# EAGLE design metaPixel-Controller (EAGLE 8.3.1)

## Sheet 1 of 2: CPU
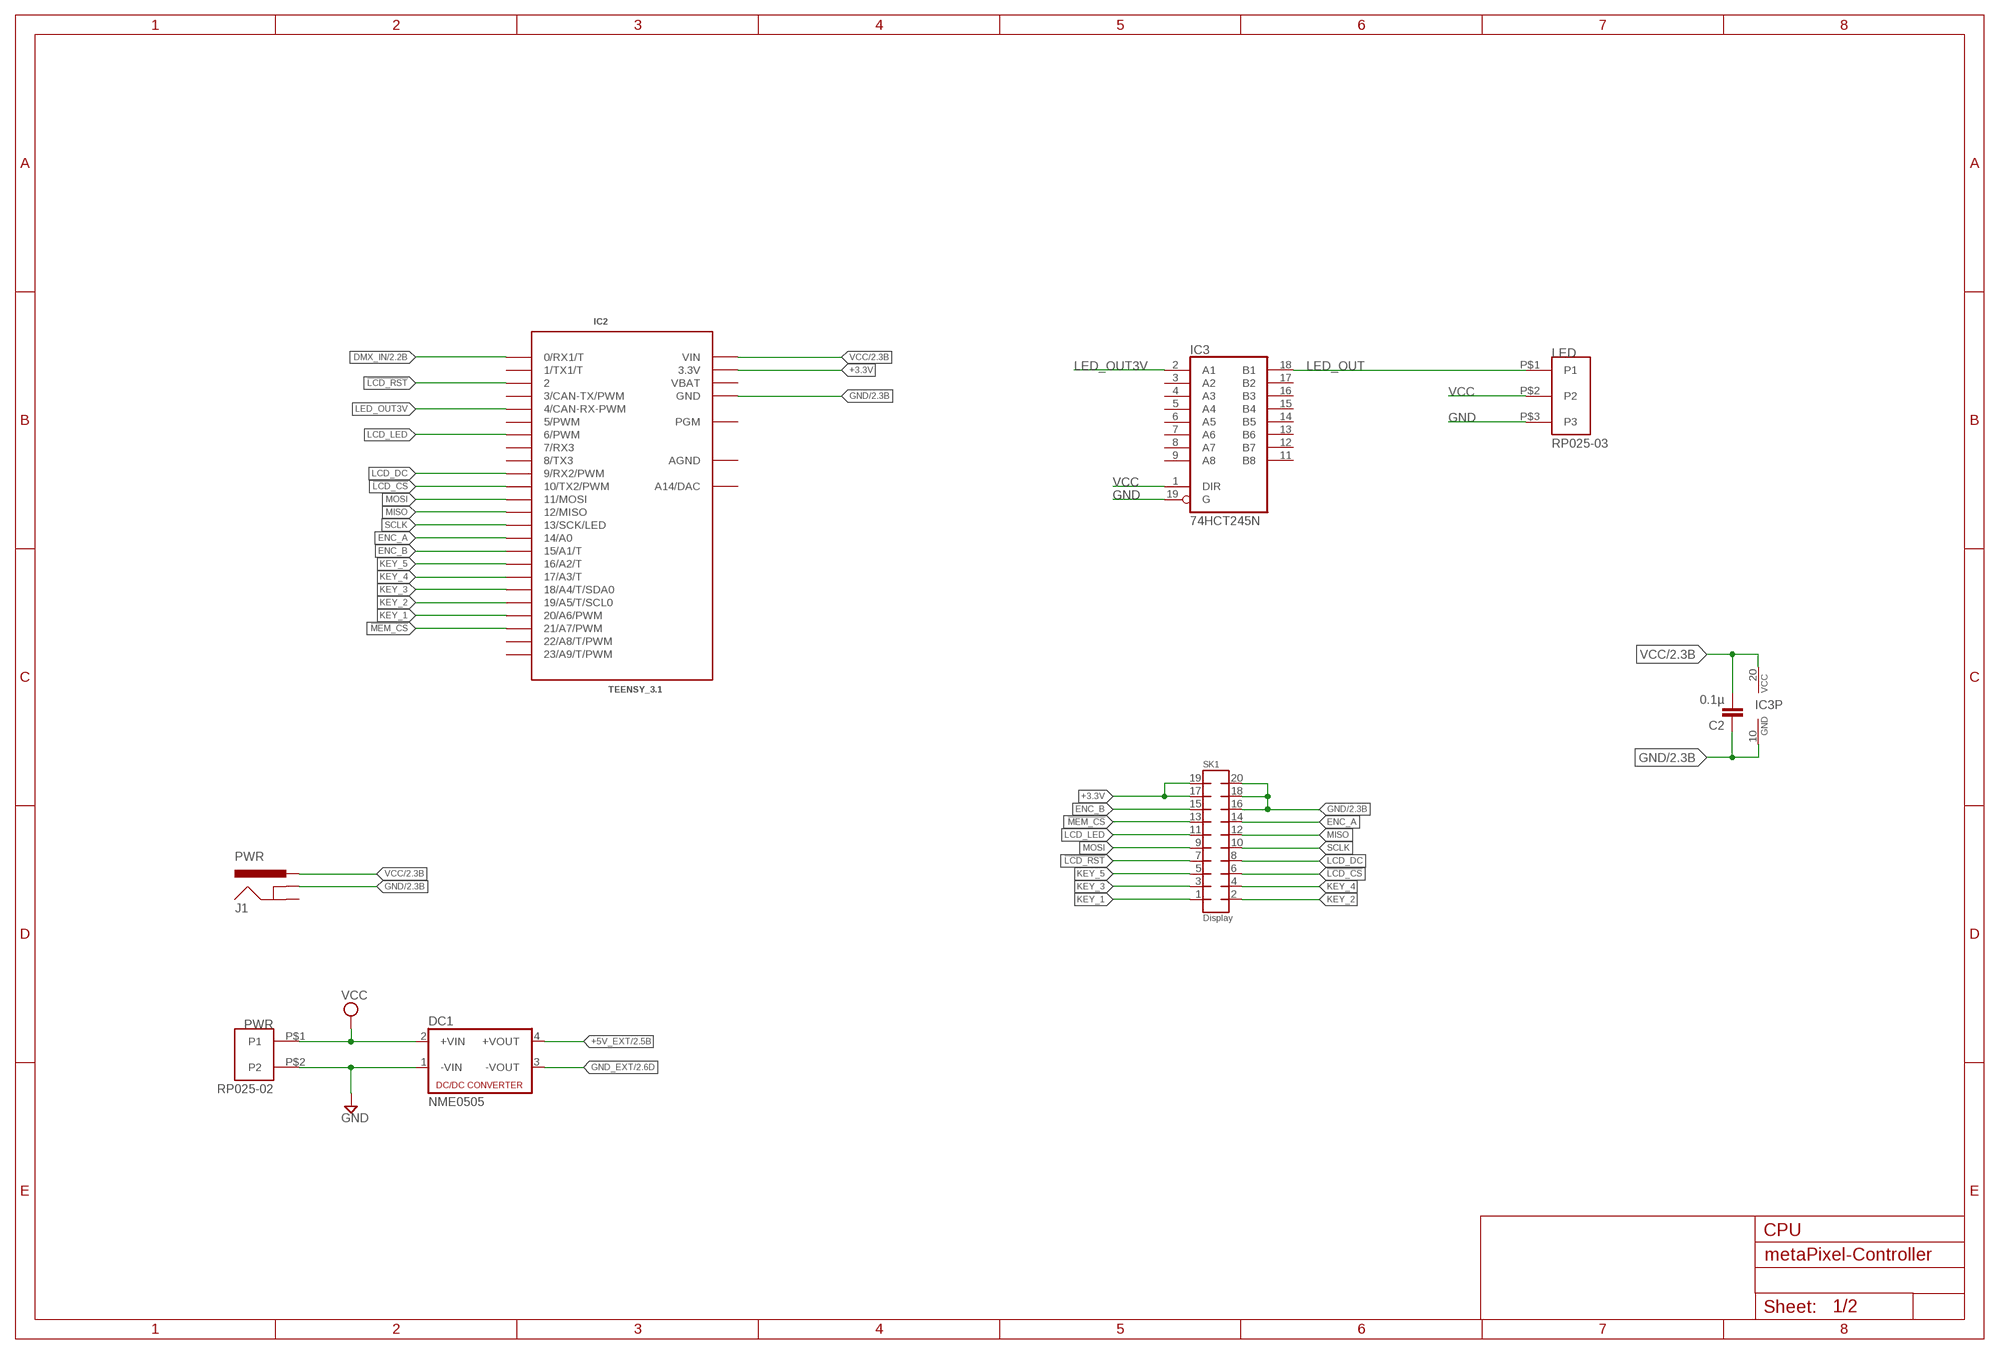
[diagram p0: schematic, sheet 1]

### Parts
C2  0.1µ  C-EU025-030X050  [C025-030X050]
DC1  NME0505  NME  [NME]
IC2  TEENSY_3.1  TEENSY_3.1_OUTER_ROW  [TEENSY3-OUTER_ROW]
IC3  74HCT245N  [DIL20]
J1  PWR  POWER_JACKSLT  [POWER_JACK_SLOT]
LED  RP025-03  [RP025-03]
PWR  RP025-02  [RP025-02]
SK1  Display  MMATCH-20-PTH  [AMP-215079-20]

### Nets
!LCD_CS: IC2.10(10/TX2/PWM) SK1.6
!LCD_RST: IC2.2 SK1.7
!MEM_CS: IC2.21/A7(21/A7/PWM) SK1.13
+3.3V [SUPPLY]: IC2.3.3V IC2.3.3V1(3.3V) SK1.17 SK1.19
+5V_EXT [SUPPLY]: DC1.4(+VOUT) ; also sheet 2
DMX_IN [SUPPLY]: IC2.0(0/RX1/T) ; also sheet 2
ENC_A: IC2.14/A0 SK1.14
ENC_B: IC2.15/A1(15/A1/T) SK1.15
GND [SUPPLY]: C2.1 DC1.1(-VIN) IC2.GND IC2.GND1(GND) IC3.10(GND) IC3.19(G) J1.GND@1(GNDBREAK) LED.P$3(P3) PWR.P$2(P2) SK1.16 SK1.18 SK1.20 ; also sheet 2
GND_EXT [SUPPLY]: DC1.3(-VOUT) ; also sheet 2
KEY_1: IC2.20/A6(20/A6/PWM) SK1.1
KEY_2: IC2.19/A5(19/A5/T/SCL0) SK1.2
KEY_3: IC2.18/A4(18/A4/T/SDA0) SK1.3
KEY_4: IC2.17/A3(17/A3/T) SK1.4
KEY_5: IC2.16/A2(16/A2/T) SK1.5
LCD_DC: IC2.9(9/RX2/PWM) SK1.8
LCD_LED: IC2.6(6/PWM) SK1.11
LED_OUT [SUPPLY]: IC3.18(B1) LED.P$1(P1)
LED_OUT3V: IC2.4(4/CAN-RX-PWM) IC3.2(A1)
MISO: IC2.12(12/MISO) SK1.12
MOSI: IC2.11(11/MOSI) SK1.9
SCLK: IC2.13(13/SCK/LED) SK1.10
VCC [SUPPLY]: C2.2 DC1.2(+VIN) IC2.VIN IC3.1(DIR) IC3.20(VCC) J1.PWR LED.P$2(P2) PWR.P$1(P1) ; also sheet 2
Unconnected: IC2.1(1/TX1/T) IC2.3(3/CAN-TX/PWM) IC2.5(5/PWM) IC2.7(7/RX3) IC2.8(8/TX3) IC2.22/A8(22/A8/T/PWM) IC2.23/A9(23/A9/T/PWM) IC2.PGM IC2.RESET/DAC(A14/DAC) IC3.3(A2) IC3.4(A3) IC3.5(A4) IC3.6(A5) IC3.7(A6) IC3.8(A7) IC3.9(A8) IC3.11(B8) IC3.12(B7) IC3.13(B6) IC3.14(B5) IC3.15(B4) IC3.16(B3) IC3.17(B2) J1.GND@2(GND)

### Notes on the sheet
- CPU

## Sheet 2 of 2
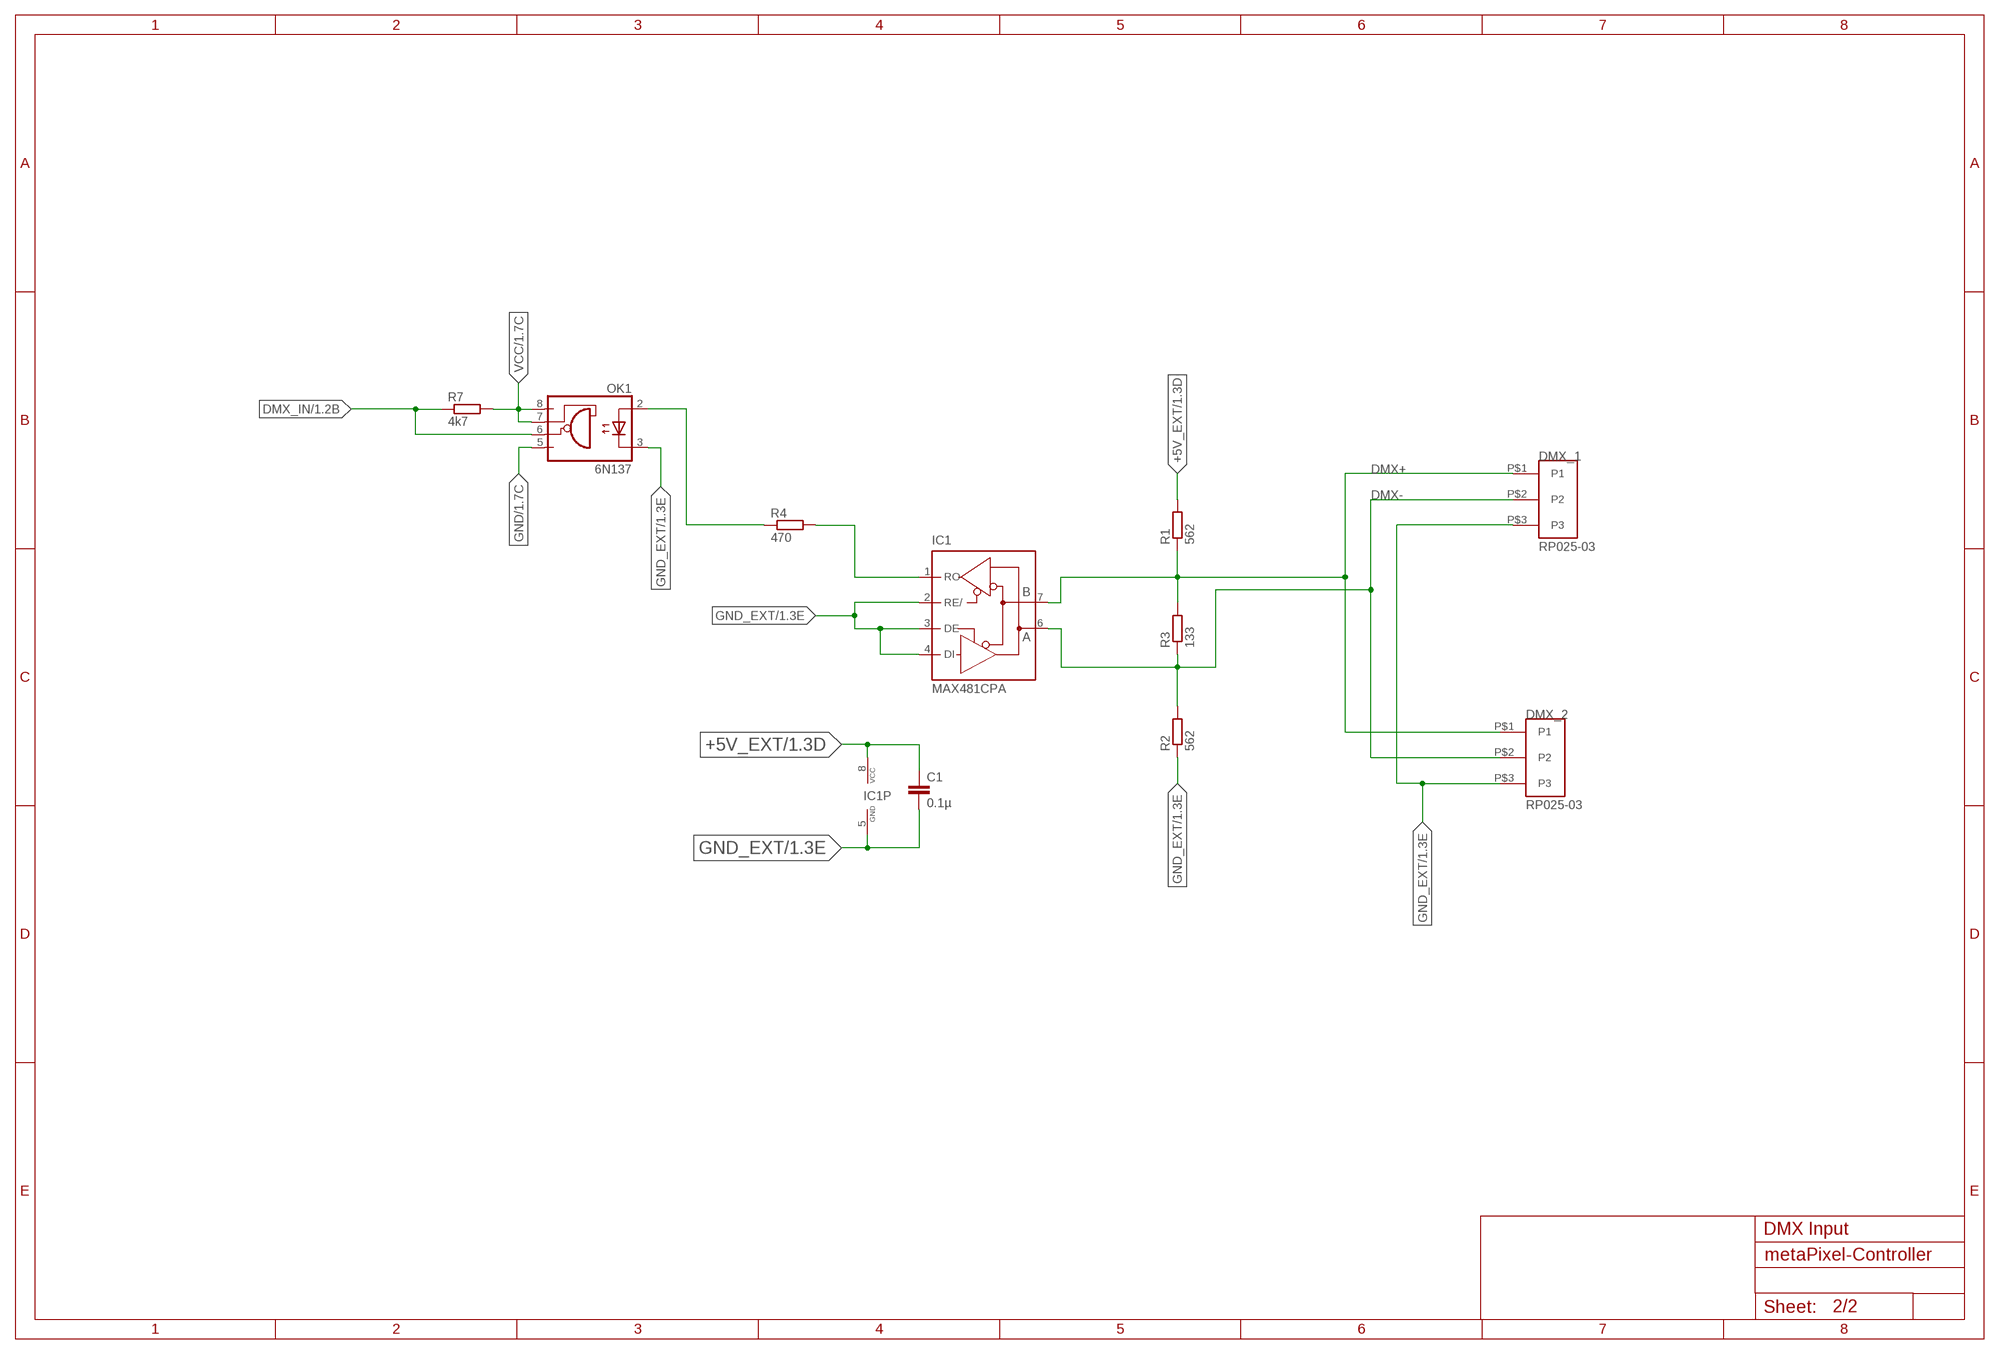
[diagram p1: schematic, sheet 2]

### Parts
C1  0.1µ  C-EU025-030X050  [C025-030X050]
DMX_1  RP025-03  [RP025-03]
DMX_2  RP025-03  [RP025-03]
IC1  MAX481CPA  [DIL08]
OK1  6N137  [DIL08]
R1  562  R-EU_0207/7  [0207/7]
R2  562  R-EU_0207/7  [0207/7]
R3  133  R-EU_0207/7  [0207/7]
R4  470  R-EU_0207/10  [0207/10]
R7  4k7  R-EU_0207/10  [0207/10]

### Nets
+5V_EXT [SUPPLY]: C1.1 IC1.8(VCC) R1.2 ; also sheet 1
DMX+ [SUPPLY]: DMX_1.P$1(P1) DMX_2.P$1(P1) IC1.7(B) R1.1 R3.2
DMX- [SUPPLY]: DMX_1.P$2(P2) DMX_2.P$2(P2) IC1.6(A) R2.2 R3.1
DMX_IN [SUPPLY]: OK1.6(VO) R7.1 ; also sheet 1
GND [SUPPLY]: OK1.5(GND) ; also sheet 1
GND_EXT [SUPPLY]: C1.2 DMX_1.P$3(P3) DMX_2.P$3(P3) IC1.2(RE/) IC1.3(DE) IC1.4(DI) IC1.5(GND) OK1.3(C) R2.1 ; also sheet 1
N$1 [SUPPLY]: OK1.2(A) R4.1
N$2 [SUPPLY]: IC1.1(RO) R4.2
VCC [SUPPLY]: OK1.7(VE) OK1.8(VCC) R7.2 ; also sheet 1

### Notes on the sheet
- DMX Input

## Power pins joined to a net without a drawn wire
AGND: IC2.AGND
VBAT: IC2.VBAT

## Library data of the parts
C1 C2 = resistor:C-EU: CAPACITOR, European symbol
DC1 = dc-dc-converter:NME: DC-DC CONVERTER; MF: C & D TECHNOLOGIES, INC; MPN: NME1205D; OC_FARNELL: 1021466; OC_NEWARK: 98B8198
DMX_1 DMX_2 LED = RP025xx:RP025-03
IC1 = maxim:MAX481CPA: RS485 TRANSEIVER; MPN: MAX481CPA+; OC_FARNELL: unknown; OC_NEWARK: 99K3445
IC2 = Teensy_3_and_LC_Series_Boards_v1.0:TEENSY_3.1_OUTER_ROW: Footprint for Teensy 3.1 or 3.2 board using all pin connections on the outer perimeter
IC3 = 74xx-eu:74*245: Octal BUS TRANSCEIVER, 3-state
J1 = SparkFun-Connectors:POWER_JACK: Power Jack This is the standard 5.5mm barrel jack for power. The PTH is the most common, proven, reliable, footprint. The Slot footprint only works if the mill layer is transmitted to the PCB fab house so be warned. Spark Fun Electronics SKU : PRT-00119 SMT: CONN-08106 Mating wall wart : TOL-00298 (and others)
OK1 = optocoupler:6N137: MOTOROLA OPTO COUPLER; MPN: 6N137; OC_FARNELL: 1328376; OC_NEWARK: 52M1895
PWR = RP025xx:RP025-02
R1-R3 R7 = resistor:R-EU_: RESISTOR, European symbol
R4 = rcl:R-EU_: RESISTOR, European symbol
SK1 = jt-con-micromatch:MMATCH-20-*: AMP Micromatch 20-pin

## Net classes
0 default: width 0.254 mm, drill 0.305 mm
1 SUPPLY: width 0.406 mm, drill 0.305 mm

## Board
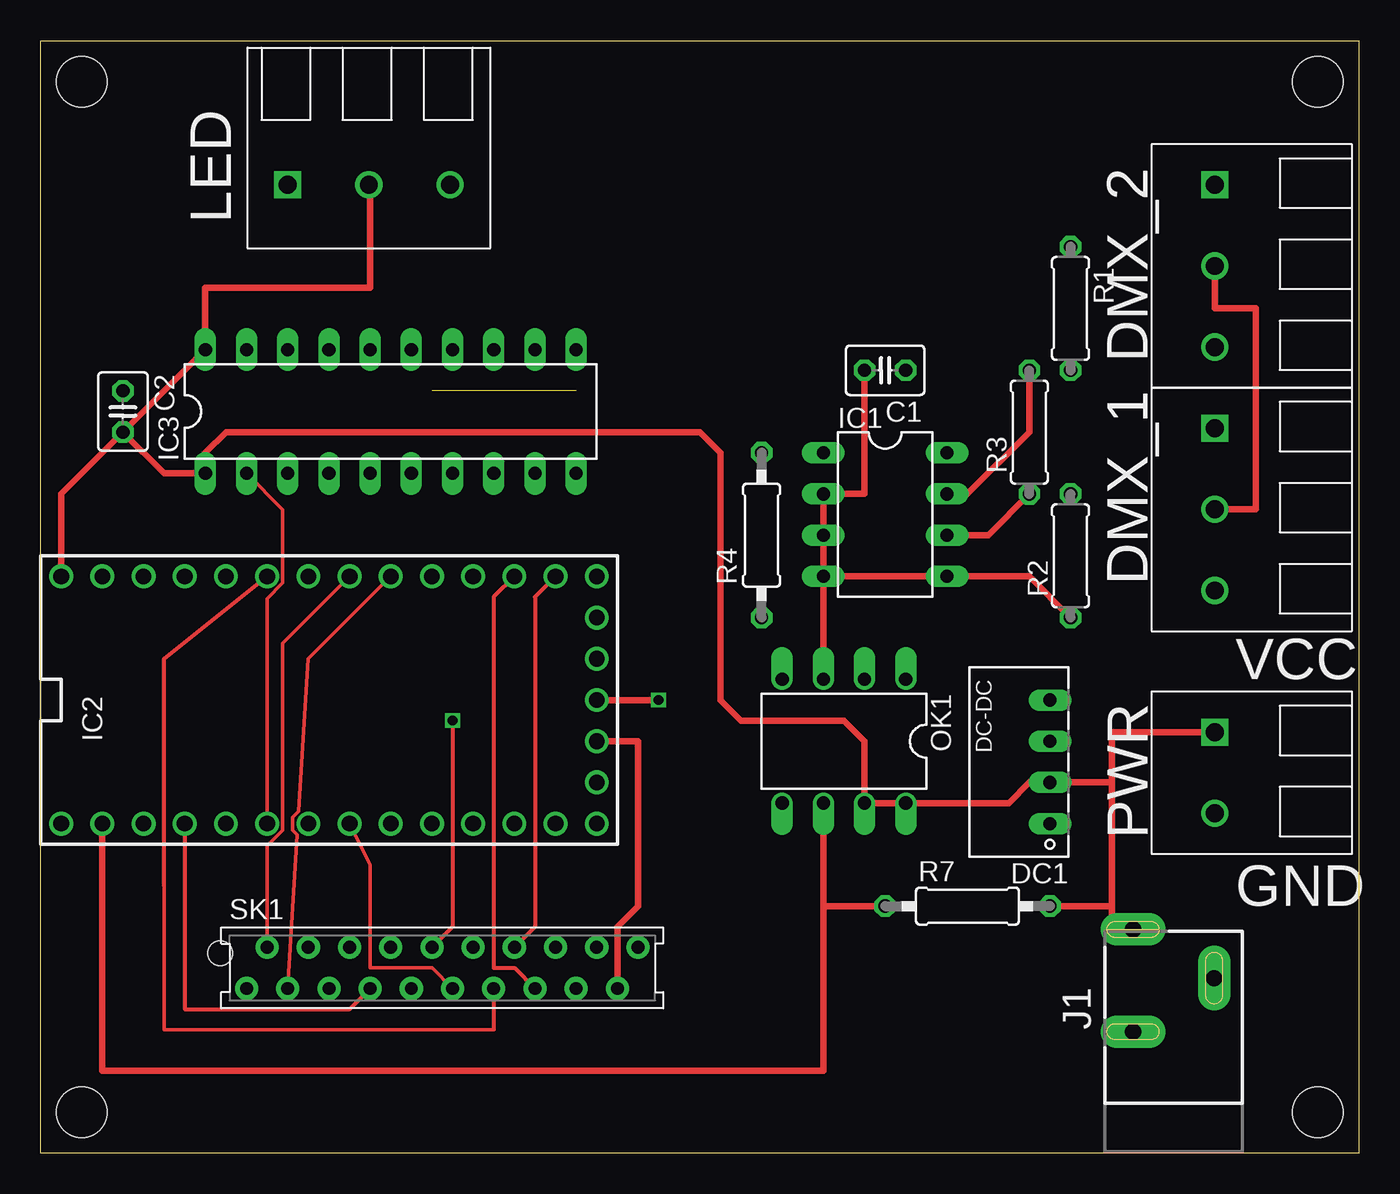
[diagram p2: board, top side]
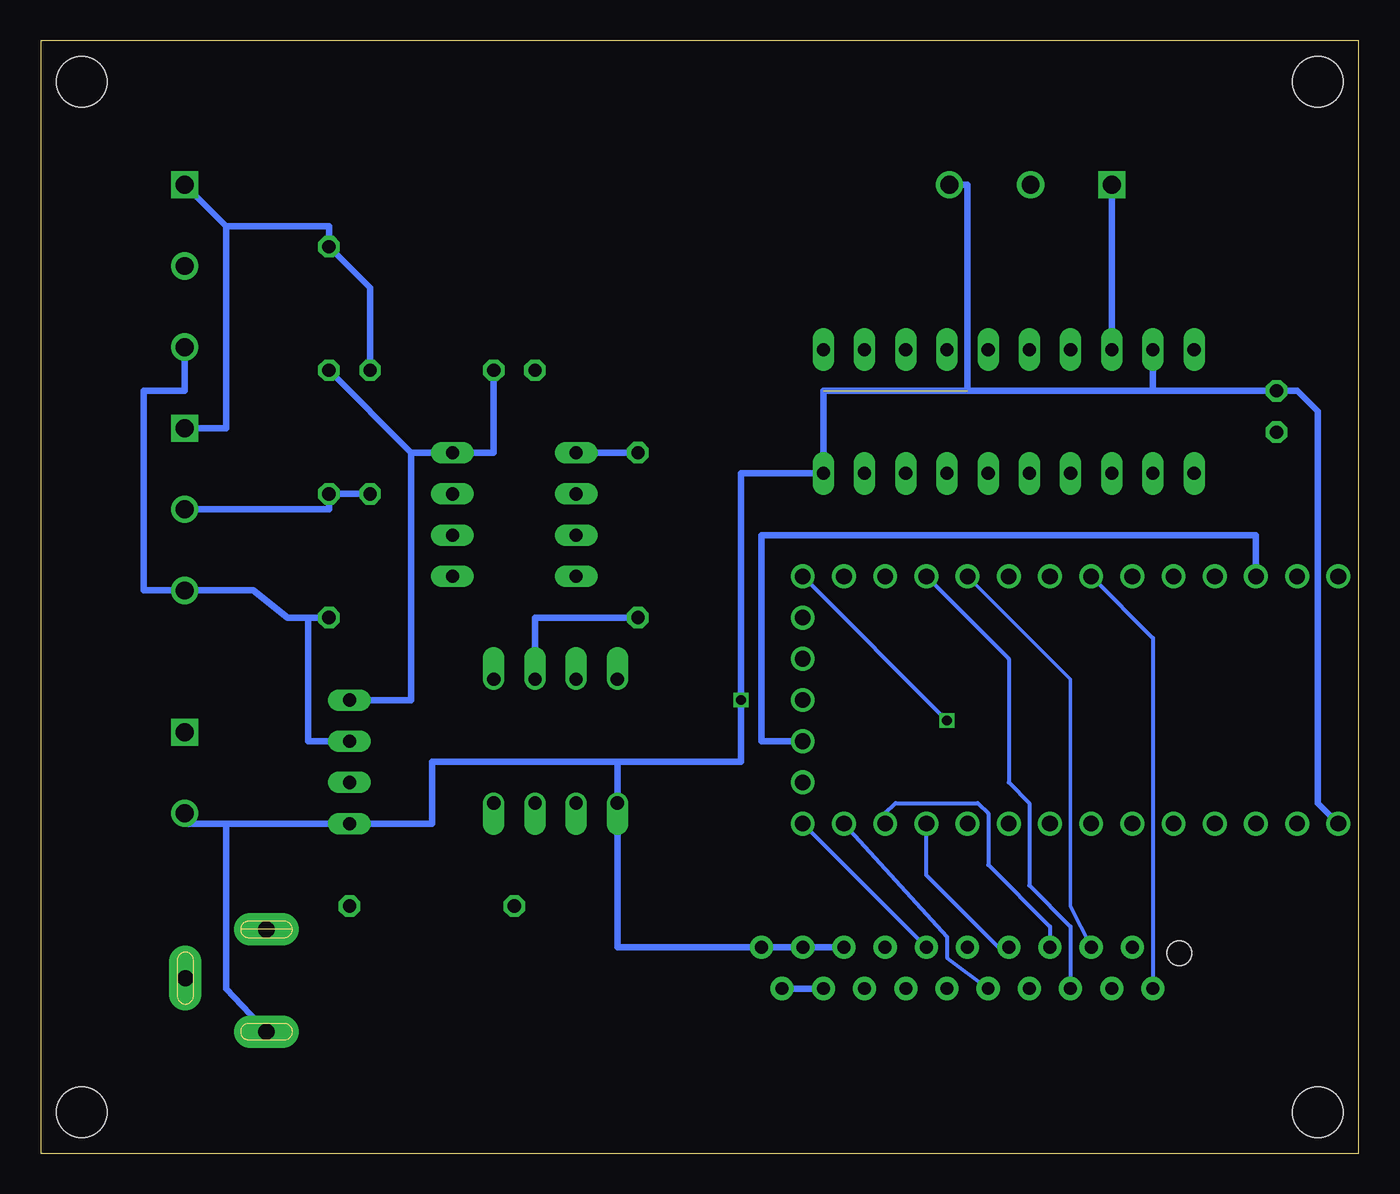
[diagram p3: board, bottom side, seen from below]

Size 81.28 x 68.58 mm. Coordinates in mm from the lower left corner, seen from the top.
Outline: 0,0 0,68.58 81.28,68.58 81.28,0 0,0
Copper layers (1*16): Top 0.035mm / dielectric 1.5mm / Bottom 0.035mm
Design rules "dirt_cheap_dirty_boards.v1": minimum track width 5mil, minimum drill 12mil, track to track 5mil, track to pad 5mil, pad to pad 5mil, via to via 5mil, smd to smd 0mil, copper to edge 10mil, drill to drill 10mil, minimum pad ring 10mil, minimum via ring 6mil, stop-mask expansion 2mil, vias tented up to drill 25mil, thermal gap 10mil
Holes 3.1 mm at 2.54,66.04 2.54,2.54 78.74,66.04 78.74,2.54

### Footprints (pad centres in the part's own frame; a part is rotated, then mirrored left to right if it is on the bottom)
C025-030X050 = drill 0.813 octagon: 1 -1.27,0; 2 1.27,0
NME = drill 0.813 long: 1 0,3.81; 2 0,1.27; 3 0,-1.27; 4 0,-3.81
RP025-03 = drill 1.1 pad 1.676 square: P$1 0,0 | drill 1.1 pad 1.676: P$2 5,0; P$3 10,0
DIL08 = drill 0.813 long: 1 -3.81,-3.81; 2 -1.27,-3.81; 3 1.27,-3.81; 4 3.81,-3.81; 5 3.81,3.81; 6 1.27,3.81; 7 -1.27,3.81; 8 -3.81,3.81
TEENSY3-OUTER_ROW = drill 0.965: 0 -7.62,13.97; 1 -7.62,11.43; 2 -7.62,8.89; 3 -7.62,6.35; 3.3V 7.62,11.43; 3.3V1 -2.54,-16.51; 4 -7.62,3.81; 5 -7.62,1.27; 6 -7.62,-1.27; 7 -7.62,-3.81; 8 -7.62,-6.35; 9 -7.62,-8.89; 10 -7.62,-11.43; 11 -7.62,-13.97; 12 -7.62,-16.51; 13 7.62,-16.51; 14/A0 7.62,-13.97; 15/A1 7.62,-11.43; 16/A2 7.62,-8.89; 17/A3 7.62,-6.35; 18/A4 7.62,-3.81; 19/A5 7.62,-1.27; 20/A6 7.62,1.27; 21/A7 7.62,3.81; 22/A8 7.62,6.35; 23/A9 7.62,8.89; AGND 7.62,13.97; GND -7.62,16.51; GND1 0,-16.51; PGM 2.54,-16.51; RESET/DAC 5.08,-16.51; VBAT -5.08,-16.51; VIN 7.62,16.51
DIL20 = drill 0.813 long: 1 -11.43,-3.81; 2 -8.89,-3.81; 3 -6.35,-3.81; 4 -3.81,-3.81; 5 -1.27,-3.81; 6 1.27,-3.81; 7 3.81,-3.81; 8 6.35,-3.81; 9 8.89,-3.81; 10 11.43,-3.81; 11 11.43,3.81; 12 8.89,3.81; 13 6.35,3.81; 14 3.81,3.81; 15 1.27,3.81; 16 -1.27,3.81; 17 -3.81,3.81; 18 -6.35,3.81; 19 -8.89,3.81; 20 -11.43,3.81
POWER_JACK_SLOT = drill 1 pad 2 long: GND@1 2.58,7.5; GND@2 7.58,10.8; PWR 2.58,13.8
DIL08' = drill 0.813 offset: 1 -3.81,-3.81; 2 -1.27,-3.81; 3 1.27,-3.81; 4 3.81,-3.81; 5 3.81,3.81; 6 1.27,3.81; 7 -1.27,3.81; 8 -3.81,3.81
RP025-02 = drill 1.1 pad 1.676 square: P$1 0,0 | drill 1.1 pad 1.676: P$2 5,0
0207/7 = drill 0.813 octagon: 1 -3.81,0; 2 3.81,0
0207/10 = drill 0.813 octagon: 1 -5.08,0; 2 5.08,0
AMP-215079-20 = drill 0.8 pad 1.422: 1 0,-1.27; 2 1.27,1.27; 3 2.54,-1.27; 4 3.81,1.27; 5 5.08,-1.27; 6 6.35,1.27; 7 7.62,-1.27; 8 8.89,1.27; 9 10.16,-1.27; 10 11.43,1.27; 11 12.7,-1.27; 12 13.97,1.27; 13 15.24,-1.27; 14 16.51,1.27; 15 17.78,-1.27; 16 19.05,1.27; 17 20.32,-1.27; 18 21.59,1.27; 19 22.86,-1.27; 20 24.13,1.27 | hole 1.5: -1.62,0.905

### Placement (x,y rotation side)
C1  52.07,48.26 180 top
C2  5.08,45.72 270 top
DC1  62.23,24.13 180 top
DMX_1  72.39,44.69 270 top
DMX_2  72.39,59.69 270 top
IC1  52.07,39.37 270 top
IC2  17.78,27.94 90 top
IC3  21.59,45.72 0 top
J1  64.77,0 0 top
LED  15.24,59.69 0 top
OK1  6N137  [DIL08']  49.53,25.4 180 top
PWR  72.39,25.96 270 top
R1  63.5,52.07 270 top
R2  63.5,36.83 90 top
R3  60.96,44.45 90 top
R4  44.45,38.1 90 top
R7  57.15,15.24 0 top
SK1  12.7,11.43 0 top

### Tracks (layer width: path | path; a pad name or v marks a point on that pad's centre or on a via)
!LCD_CS
  Bottom 0.254: IC2.10 29.21,20.95 28.57,21.59 23.5,21.59 22.86,20.95 22.86,17.78 19.05,13.97 SK1.6
!LCD_RST
  Top 0.254: SK1.7 19.05,8.89 8.89,8.89 IC2.2
!MEM_CS
  Top 0.203: 27.94,7.62 7.62,7.62 7.62,16.51
  Top 0.254: SK1.13 27.94,7.62 | 7.62,16.51 7.62,30.48 IC2.21/A7
+3.3V
  Top 0.406: IC2.3.3V1 36.83,25.4 36.83,15.24 35.56,13.97 SK1.19
  Bottom 0.406: IC2.3.3V 6.35,38.1 36.83,38.1 36.83,25.4 IC2.3.3V1 | SK1.19 SK1.17
+5V_EXT
  Bottom 0.406: R1.2 58.42,43.18 | C1.1 53.34,43.18 IC1.8 58.42,43.18 | 58.42,43.18 58.42,27.94 DC1.4
DMX+
  Top 0.406: R3.2 60.96,44.45 57.15,40.64 IC1.7
  Bottom 0.406: DMX_2.P$1 69.85,57.15 | 69.85,57.15 63.5,57.15 R1.1 60.96,53.34 R3.2 | DMX_1.P$1 69.85,44.69 69.85,57.15
DMX-
  Top 0.406: DMX_1.P$2 74.93,39.69 74.93,52.07 72.39,52.07 DMX_2.P$2 | R3.1 58.42,38.1 IC1.6
  Bottom 0.406: DMX_1.P$2 63.5,39.69 R2.2 R3.1
DMX_IN
  Top 0.406: 48.26,15.24 48.26,5.08 3.81,5.08 IC2.0 | 48.26,15.24 OK1.6 | R7.1 48.26,15.24
ENC_A
  Top 0.254: SK1.14 30.48,13.97 30.48,34.29 IC2.14/A0
ENC_B
  Top 0.254: SK1.15 29.21,11.43 27.94,11.43 27.94,34.29 IC2.15/A1
GND  (via drill 0.6)  (1 unrouted)
  Top 0.406: IC2.GND1 v38.1,27.94
  Bottom 0.406: PWR.P$2 72.39,20.32 69.85,20.32 | 69.85,20.32 DC1.1 57.15,20.32 57.15,24.13 45.72,24.13 | 45.72,24.13 OK1.5 45.72,12.7 SK1.20 SK1.18 SK1.16 | 12.7,46.99 33.02,46.99 IC3.10 38.1,41.91 v38.1,27.94 38.1,24.13 45.72,24.13 | 12.7,46.99 IC3.19 | 12.7,46.99 C2.1 3.81,46.99 2.54,45.72 2.54,21.59 IC2.GND | J1.GND@1 69.85,10.16 69.85,20.32 | 24.13,46.99 24.13,59.69 LED.P$3
GND_EXT
  Top 0.406: R2.1 60.96,35.56 IC1.5 IC1.4 | IC1.4 IC1.3 IC1.2 50.8,40.64 C1.2 | IC1.4 OK1.3
  Bottom 0.406: DMX_2.P$3 72.39,46.99 74.93,46.99 74.93,34.69 DMX_1.P$3 68.18,34.69 66.04,33.02 64.77,33.02 | R2.1 64.77,33.02 | 64.77,33.02 64.77,25.4 DC1.3
KEY_1
  Bottom 0.254: SK1.1 12.7,31.75 IC2.20/A6
KEY_2
  Top 0.203: SK1.2 13.97,18.95 14.94,19.92 14.94,31.45 IC2.19/A5
KEY_3
  Top 0.203: IC2.18/A4 16.51,30.48 15.92,21.1 15.54,20.72 15.54,19.92 15.83,19.63 SK1.3
KEY_4
  Bottom 0.203: SK1.4 17.78,15.24 17.78,29.21 IC2.17/A3
KEY_5
  Bottom 0.254: IC2.16/A2 21.59,30.48 21.59,22.86 20.32,21.59 20.32,16.51 17.78,13.97 SK1.5
LCD_DC
  Bottom 0.254: SK1.8 22.23,12.7 26.67,17.14 IC2.9
LCD_LED
  Top 0.203: SK1.11 24.13,11.43 20.32,11.43 20.32,17.78 IC2.6
LED_OUT
  Bottom 0.406: IC3.18 LED.P$1
LED_OUT3V
  Top 0.203: IC2.4 13.97,34.2 14.94,35.16 14.94,39.67 IC3.2
MISO
  Bottom 0.254: IC2.12 SK1.12
MOSI
  Bottom 0.254: SK1.9 25.4,12.06 25.4,13.34 IC2.11
N$1
  Bottom 0.406: R4.1 50.8,33.02 OK1.2
N$2
  Bottom 0.406: IC1.1 R4.2
SCLK  (via drill 0.6)
  Top 0.254: v25.4,26.67 25.4,13.97 SK1.10
  Bottom 0.254: IC2.13 v25.4,26.67
VCC
  Top 0.152: 20.32,59.61 LED.P$2
  Top 0.406: R7.2 66.04,15.24 | 66.04,15.24 66.04,22.86 | 66.04,22.86 DC1.2 60.96,22.86 59.69,21.59 OK1.8 OK1.7 50.8,25.4 49.53,26.67 43.18,26.67 41.91,27.94 41.91,43.18 40.64,44.45 11.43,44.45 10.16,43.18 IC3.1 7.62,41.91 C2.2 | IC2.VIN 1.27,40.64 C2.2 | C2.2 IC3.20 10.16,53.34 20.32,53.34 20.32,59.61 | PWR.P$1 66.04,25.96 66.04,22.86 | J1.PWR 66.04,13.97 66.04,15.24

### Text on the board
tNames: VCC | GND